# Altium schematic sheet The Lights.SchDoc
size A4
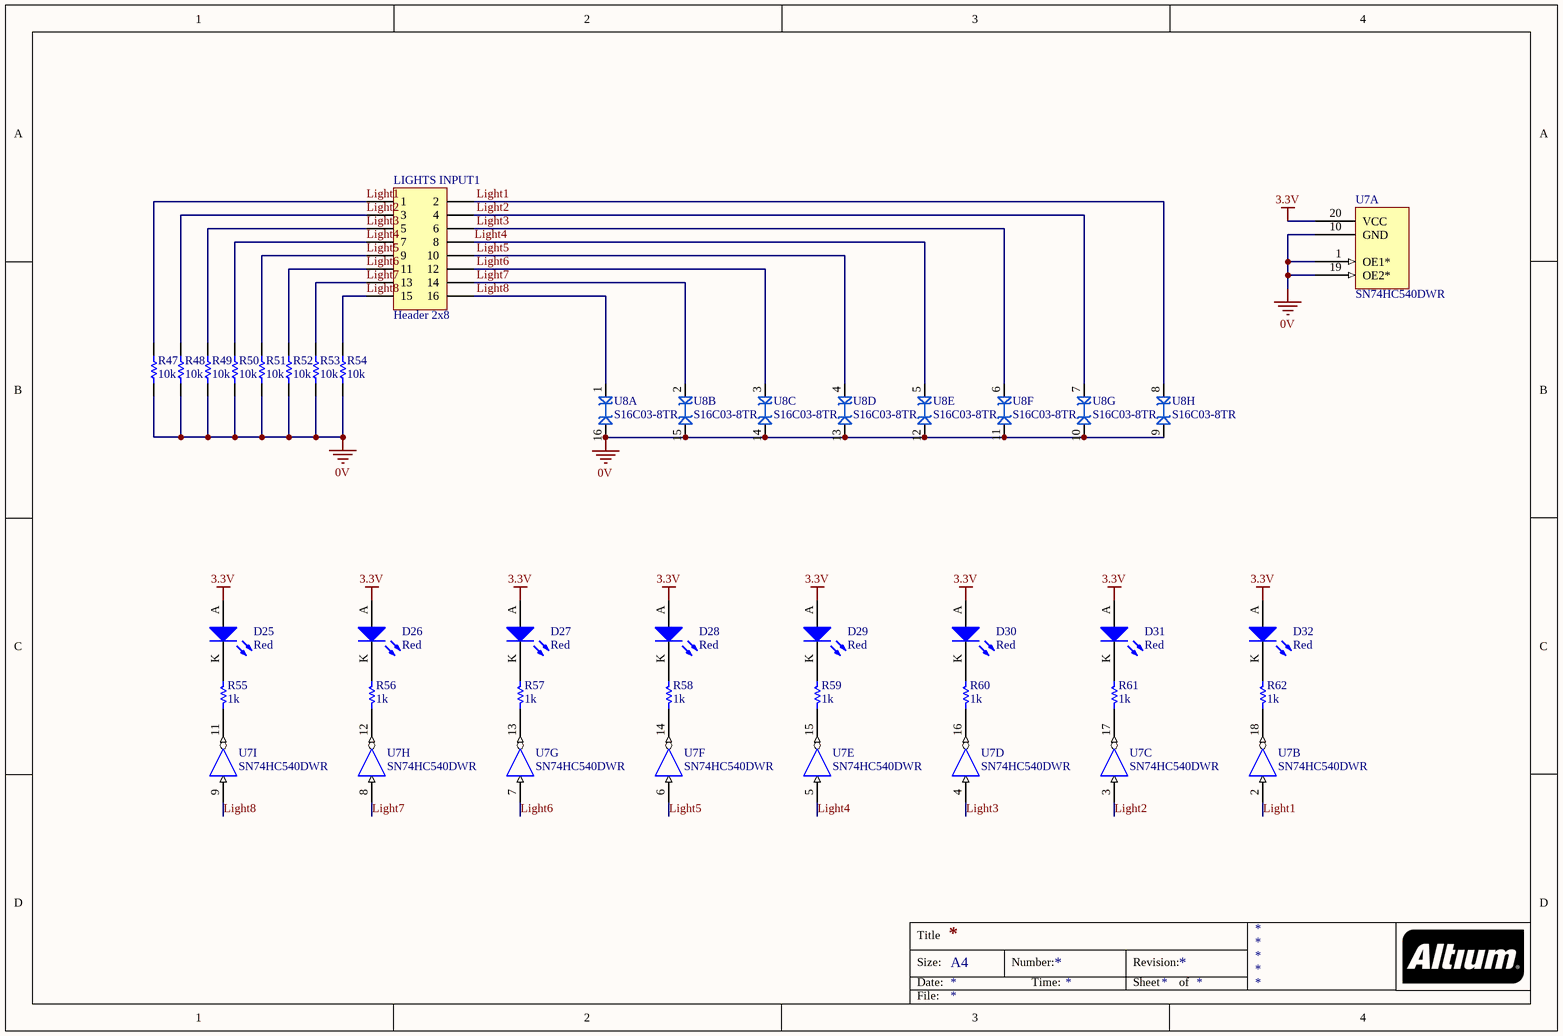
[diagram p0: The Lights.SchDoc]

## Parts
D25  Red  [0805 LED]
D26  Red  [0805 LED]
D27  Red  [0805 LED]
D28  Red  [0805 LED]
D29  Red  [0805 LED]
D30  Red  [0805 LED]
D31  Red  [0805 LED]
D32  Red  [0805 LED]
LIGHTS_INPUT1  Header 2x8  [Header 2x8]
R47  10k  [0805]
R48  10k  [0805]
R49  10k  [0805]
R50  10k  [0805]
R51  10k  [0805]
R52  10k  [0805]
R53  10k  [0805]
R54  10k  [0805]
R55  1k  [0805]
R56  1k  [0805]
R57  1k  [0805]
R58  1k  [0805]
R59  1k  [0805]
R60  1k  [0805]
R61  1k  [0805]
R62  1k  [0805]
U7  SN74HC540DWR  [TI 20-SOIC]  (parts A,B,C,D,E,F,G,H,I of 9)
U8  S16C03-8TR  [SMC 16-SOIC]  (parts A,B,C,D,E,F,G,H of 8)

## Nets
0V: R47.1 R48.1 R49.1 R50.1 R51.1 R52.1 R53.1 R54.1 U7.1(OE1*) U7.10(GND) U7.19(OE2*) U8.9(A) U8.10(A) U8.11(A) U8.12(A) U8.13(A) U8.14(A) U8.15(A) U8.16(A)
3.3V: D25.A D26.A D27.A D28.A D29.A D30.A D31.A D32.A U7.20(VCC)
Light1: LIGHTS_INPUT1.1 LIGHTS_INPUT1.2 R47.2 U7.2(A1) U8.8(A)
Light2: LIGHTS_INPUT1.3 LIGHTS_INPUT1.4 R48.2 U7.3(A2) U8.7(A)
Light3: LIGHTS_INPUT1.5 LIGHTS_INPUT1.6 R49.2 U7.4(A3) U8.6(A)
Light4: LIGHTS_INPUT1.7 LIGHTS_INPUT1.8 R50.2 U7.5(A4) U8.5(A)
Light5: LIGHTS_INPUT1.9 LIGHTS_INPUT1.10 R51.2 U7.6(A5) U8.4(A)
Light6: LIGHTS_INPUT1.11 LIGHTS_INPUT1.12 R52.2 U7.7(A6) U8.3(A)
Light7: LIGHTS_INPUT1.13 LIGHTS_INPUT1.14 R53.2 U7.8(A7) U8.2(A)
Light8: LIGHTS_INPUT1.15 LIGHTS_INPUT1.16 R54.2 U7.9(A8) U8.1(A)
NetD25_K: D25.K R55.1
NetD26_K: D26.K R56.1
NetD27_K: D27.K R57.1
NetD28_K: D28.K R58.1
NetD29_K: D29.K R59.1
NetD30_K: D30.K R60.1
NetD31_K: D31.K R61.1
NetD32_K: D32.K R62.1
NetR55_2: R55.2 U7.11(Y8)
NetR56_2: R56.2 U7.12(Y7)
NetR57_2: R57.2 U7.13(Y6)
NetR58_2: R58.2 U7.14(Y5)
NetR59_2: R59.2 U7.15(Y5)
NetR60_2: R60.2 U7.16(Y3)
NetR61_2: R61.2 U7.17(Y2)
NetR62_2: R62.2 U7.18(Y1)

## Notes on the sheet
- Title
- Size:
- Date:
- A4
- Number:
- Time:
- Revision:
- Sheet
- of
- File:

## Library data of the parts
D25-D32 = SML-210LTT86: Red LED Indication - Discrete 1.75V 0805 (2012 Metric); Manufacturer: ROHM Semiconductor; Part Number: SML-210LTT86; Colour: Red; Digikey Part Number: 511-1286-1-ND; Digikey Link: https://www.digikey.com/product-detail/en/rohm-semiconductor/SML-210LTT86/511-1286-1-ND/637099
LIGHTS_INPUT1 = Header 2x8: Positions: 16; Pitch: 2.54mm; Angle: 0; Flange: No; Contact: NA; Part Number: Header 2x8; Row Spacing: 2.54mm
R47-R54 = RC0805FR0710KL: Manufacturer: YAGEO; Tolerance: 0.01; Rated Voltage: 0.125W; Part Number: RC0805FR0710KL; Value: 10k; Material: FR-07; qty: 50
R55-R62 = RC0805FR071KL: Manufacturer: YAGEO; Tolerance: 0.01; Rated Voltage: 0.125W; Part Number: RC0805FR071KL; Value: 1k; Material: FR-07; qty: 50
U7 = SN74HC540DWR: IC BUFFER INVERT 6V 20SOIC; Manufacturer: Texas Instruments; Part Number: SN74HC540DWR; Digikey Part Number: 296-8333-1-ND; Digikey Link: https://www.digikey.com/product-detail/en/texas-instruments/SN74HC540DWR/296-8333-1-ND/376710
U8 = S16C03-8TR: PD 300W VWM 3.3VCJ 425PFPACKAGE; Manufacturer: SMC Diode; Part Number: S16C03-8TR; Digikey Part Number: 1655-2152-2-ND; Digikey Link: https://www.digikey.com/product-detail/en/smc-diode-solutions/S16C03-8TR/1655-2152-2-ND/9816814